# Altium schematic sheet IOT_GRN_MAIN V1.0 A - ESP32.SchDoc
size A4; SheetNumber: 2; SheetTotal: 4; Sheet Title: ESP32-C6
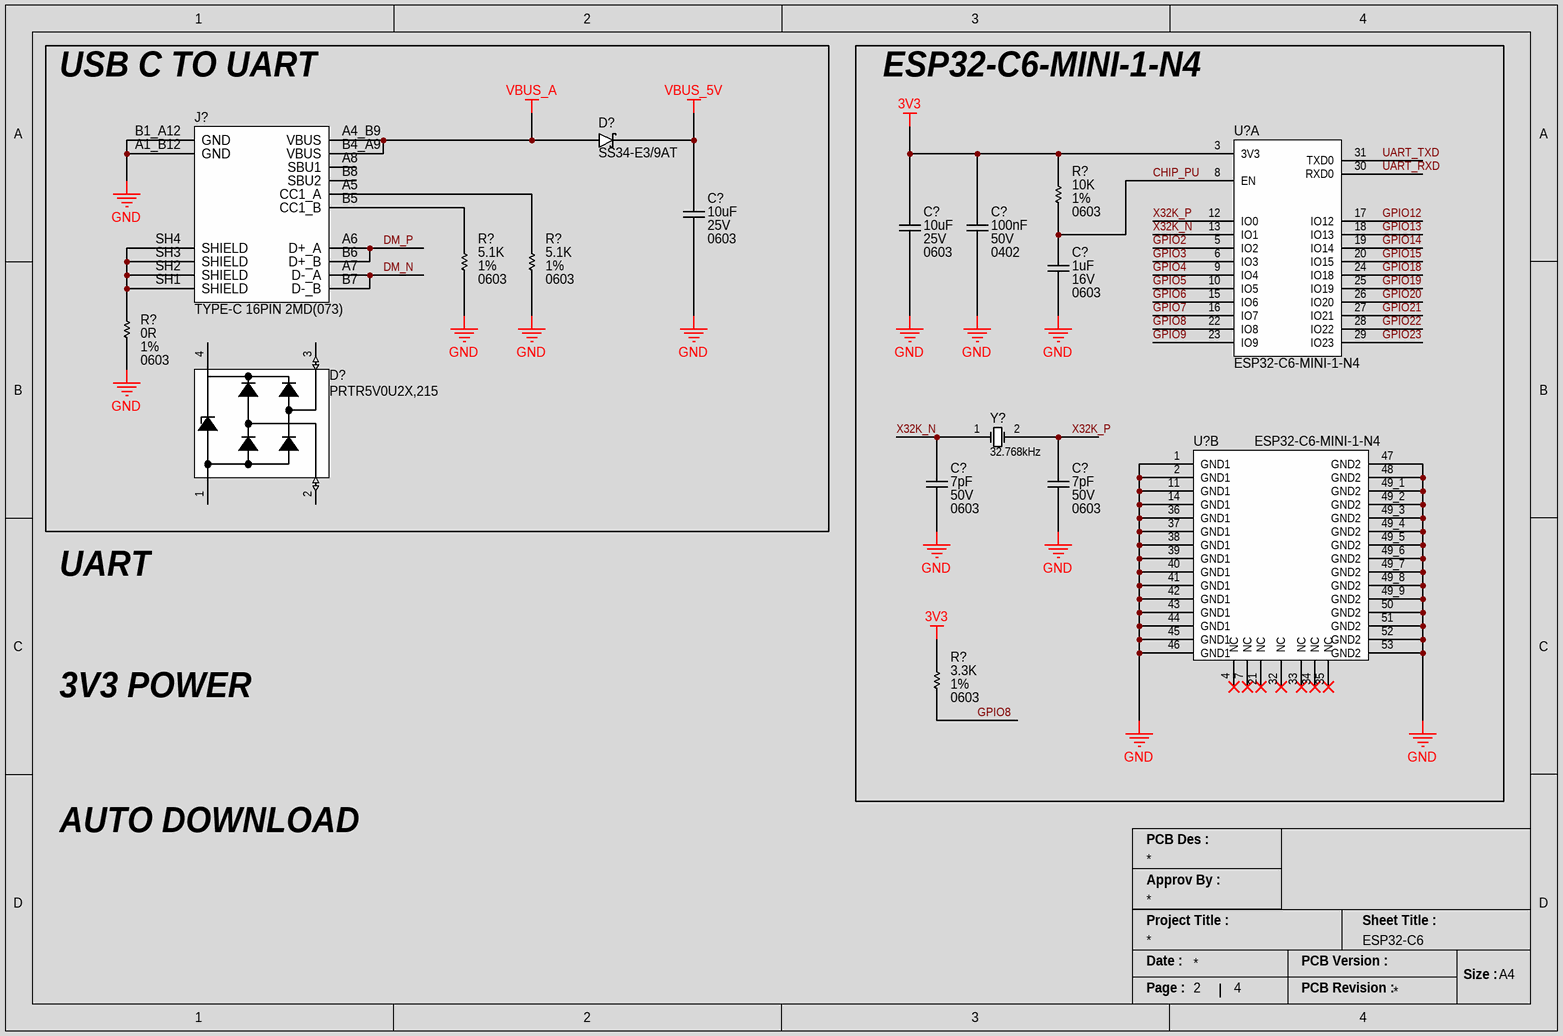
[diagram p0: IOT_GRN_MAIN V1.0 A - ESP32.SchDoc]

## Parts
(Parts that share a designator on the sheet are numbered #1, #2 ... from top to bottom, then left to right.)
C?#1  Case/Package: 0603  Capacitance: 10uF  Voltage Rating: 25V  [CAP_0603_CAPC1608X08N]  (hidden comment: GRM188R61E106MA73D)
C?#2  Case/Package: 0603  Capacitance: 10uF  Voltage Rating: 25V  [CAP_0603_CAPC1608X08N]  (hidden comment: GRM188R61E106MA73D)
C?#3  Voltage Rating: 50V  Capacitance: 100nF  Case/Package: 0402  [CAP_0402_CAPC1005X05N]  (hidden comment: GRM155R71H104KE14D)
C?#4  Voltage Rating: 16V  Capacitance: 1uF  Case/Package: 0603  [CAP_0603_CAPC1608X08N]  (hidden comment: CL10A105KO8NNNC)
C?#5  Voltage Rating (DC): 50V  Capacitance: 7pF  Case/Package: 0603  [CAP_0603_CAPC1608X08N]  (hidden comment: C1608C0G1H070D080AA)
C?#6  Voltage Rating (DC): 50V  Capacitance: 7pF  Case/Package: 0603  [CAP_0603_CAPC1608X08N]  (hidden comment: C1608C0G1H070D080AA)
D?#1  SS34-E3/9AT  [DIO_Vishay_SMC_MFG]
D?#2  PRTR5V0U2X,215  [DIO_TVS_Nexperia_SOT143B_MFG]
J?  TYPE-C 16PIN 2MD(073)  [CONN_USB_C_16P]
R?#1  Resistance: 10K  Tolerance: 1%  Case/Package: 0603  [RES_0603_RESC1608X04N]  (hidden comment: AC0603FR-1010KL)
R?#2  Tolerance: 1%  Resistance: 5.1K  Case/Package: 0603  [RES_0603_RESC1608X04N]  (hidden comment: RC0603FR-075K1L)
R?#3  Tolerance: 1%  Resistance: 5.1K  Case/Package: 0603  [RES_0603_RESC1608X04N]  (hidden comment: RC0603FR-075K1L)
R?#4  Tolerance: 1%  Resistance: 0R  Case Code (Imperial): 0603  [RES_0603_RESC1608X04N]  (hidden comment: RC0603FR-070RL)
R?#5  Tolerance: 1%  Resistance: 3.3K  Case/Package: 0603  [RES_0603_RESC1608X04N]  (hidden comment: RC0603FR-073K3L)
U?#1  ESP32-C6-MINI-1-N4  [IC_ESP32-C6-MINI-1-N4]  (part A of 2)
U?#2  ESP32-C6-MINI-1-N4  [IC_ESP32-C6-MINI-1-N4]  (part B of 2)
Y?  Frequency: 32.768kHz  [CRYSTAL_FC135327680KAAG5]  (hidden comment: FC-135 32.7680KA-AG5)

## Blocks framed on the sheet
USB C TO UART: C?#1 D?#1 D?#2 J? R?#2-R?#4
ESP32-C6-MINI-1-N4: C?#2-C?#6 R?#1 R?#5 U?#1 U?#2 Y?

## Nets
3V3: C?#2.2 C?#3.2 R?#1.2 R?#5.2 U?#1.3(3V3)
GND: C?#1.1 C?#2.1 C?#3.1 C?#4.1 C?#5.2 C?#6.1 J?.A1_B12(GND) J?.B1_A12(GND) R?#2.1 R?#3.1 R?#4.1 U?#2.1(GND1) U?#2.2(GND1) U?#2.11(GND1) U?#2.14(GND1) U?#2.36(GND1) U?#2.37(GND1) U?#2.38(GND1) U?#2.39(GND1) U?#2.40(GND1) U?#2.41(GND1) U?#2.42(GND1) U?#2.43(GND1) U?#2.44(GND1) U?#2.45(GND1) U?#2.46(GND1) U?#2.47(GND2) U?#2.48(GND2) U?#2.49_1(GND2) U?#2.49_2(GND2) U?#2.49_3(GND2) U?#2.49_4(GND2) U?#2.49_5(GND2) U?#2.49_6(GND2) U?#2.49_7(GND2) U?#2.49_8(GND2) U?#2.49_9(GND2) U?#2.50(GND2) U?#2.51(GND2) U?#2.52(GND2) U?#2.53(GND2)
VBUS_5V: C?#1.2 D?#1.1(K)
VBUS_A: D?#1.2(A) J?.A4_B9(VBUS) J?.B4_A9(VBUS)
CHIP_PU: C?#4.2 R?#1.1 U?#1.8(EN)
DM_N: J?.A7(D-_A) J?.B7(D-_B)
DM_P: J?.A6(D+_A) J?.B6(D+_B)
GPIO2: U?#1.5(IO2)
GPIO3: U?#1.6(IO3)
GPIO4: U?#1.9(IO4)
GPIO5: U?#1.10(IO5)
GPIO6: U?#1.15(IO6)
GPIO7: U?#1.16(IO7)
GPIO8: R?#5.1 U?#1.22(IO8)
GPIO9: U?#1.23(IO9)
GPIO12: U?#1.17(IO12)
GPIO13: U?#1.18(IO13)
GPIO14: U?#1.19(IO14)
GPIO15: U?#1.20(IO15)
GPIO18: U?#1.24(IO18)
GPIO19: U?#1.25(IO19)
GPIO20: U?#1.26(IO20)
GPIO21: U?#1.27(IO21)
GPIO22: U?#1.28(IO22)
GPIO23: U?#1.29(IO23)
UART_RXD: U?#1.30(RXD0)
UART_TXD: U?#1.31(TXD0)
X32K_N: C?#6.2 U?#1.13(IO1) Y?.1(OSC1)
X32K_P: C?#5.1 U?#1.12(IO0) Y?.2(OSC2)
NetJ?_A5: J?.A5(CC1_A) R?#3.2
NetJ?_B5: J?.B5(CC1_B) R?#2.2
NetJ?_SH1: J?.SH1(SHIELD) J?.SH2(SHIELD) J?.SH3(SHIELD) J?.SH4(SHIELD) R?#4.2

Not connected (* = marked no-connect by the designer): D?#2 1(GND) 2(I/O_1) 3(I/O_2) 4(VCC); J? A8(SBU1) B8(SBU2); U?#2 4(NC)* 7(NC)* 21(NC)* 32(NC)* 33(NC)* 34(NC)* 35(NC)*

## Notes on the sheet
- UART
- 3V3 POWER
- AUTO DOWNLOAD
- PCB Des :
- Approv By :
- Project Title :
- Sheet Title :
- Date :
- PCB Version :
- Size :
- A4
- Page :
- PCB Revision :

## Library data of the parts
C?#1 C?#2 = CAP_10UF_25V_X5R_0603: Multilayer Ceramic Capacitor, 10 uF, 25 V, ± 20%, X5R, 0603 [1608 Metric]; Manufacturer: Murata; Material: 4241ConductorMaterial; Supplier 1: Digi-Key; Manufacturer Part Number: GRM188R61E106MA73D; RoHS: Yes; Category: Ceramic Capacitors; Stock 1: 2712970; Pricing 1: 1=0.26, 10=0.168, 50=0.1176, 100=0.0949, 500=0.07054, 1000=0.06173 (USD); Mount: Surface Mount; Number of Pins: 2; Case Code (Imperial): 0603; Weight: 0.000222oz; Min Operating Temperature: -55°C; Max Operating Temperature: 85°C; Tolerance: 20%; Packaging: Cut Tape; Package Quantity: 1; Dielectric: X5R; Voltage: 25V; Termination: SMD/SMT; Voltage Rating (DC): 25V; Series: GRM; Construction: Flat; Length: 1.6mm; Width: 0.031inch; Height: 0.8mm; Thickness: 0.031inch; Depth: 0.8mm; Reach SVHC Compliant: No; Lead Free: Lead Free; RoHS Compliant: Yes; ComponentLink1URL: https://datasheet.ciiva.com/22776/c02e-22776427.pdf?src-supplier=Farnell; ComponentLink1Description: https://datasheet.ciiva.com/22776/c02e-22776427.pdf?src-supplier=Farnell; ComponentLink2URL: https://datasheet.ciiva.com/22619/c02e-22619674.pdf?src-supplier=Element14; ComponentLink2Description: https://datasheet.ciiva.com/22619/c02e-22619674.pdf?src-supplier=Element14; ComponentLink3URL: https://datasheet.ciiva.com/22776/608985-22776426.pdf?src-supplier=Farnell; ComponentLink3Description: https://datasheet.ciiva.com/22776/608985-22776426.pdf?src-supplier=Farnell; ComponentLink4URL: https://datasheet.ciiva.com/14906/partnumbering-e-01-14906431.pdf?src-supplier=Digi-Key; ComponentLink4Description: https://datasheet.ciiva.com/14906/partnumbering-e-01-14906431.pdf?src-supplier=Digi-Key; ComponentLink5URL: https://datasheet.ciiva.com/14906/partnumbering-e-01-14906429.pdf?src-supplier=Digi-Key; ComponentLink5Description: https://datasheet.ciiva.com/14906/partnumbering-e-01-14906429.pdf?src-supplier=Digi-Key; Supplier Part Number 1: 490-7202-1-ND; Case Code (Metric): 1608
C?#3 = CAP_100NF_50V_X7R_0402: Multilayer Ceramic Capacitor, 0.1 uF, 16 V, ± 10%, X7R, 0402 [1005 Metric]; Manufacturer: Murata; Dissipation Factor: 0.025%; Temperature Coefficient: 30ppm/°C; Supplier 1: DigiKey; Manufacturer Part Number: GRM155R71H104KE14D; RoHS: Yes; Category: Ceramic Capacitors; Stock 1: 13730790; Pricing 1: 1=0.1, 10=0.023, 50=0.0132, 100=0.0102, 500=0.00768, 1000=0.00603, 2500=0.00548, 5000=0.00504 (USD); Mount: Surface Mount; Number of Pins: 2NUMBER; Case Code (Metric): 1005; Material: Ceramic; Case Code (Imperial): 0402; Weight: 0.000212oz; Dielectric Material: Ceramic; Min Operating Temperature: -55°C; Max Operating Temperature: 125°C; Packaging: Tape and Reel; Package Quantity: 10000; Series: GRM; Tolerance: 10%; Dielectric: X7R; Termination: SMD/SMT; Voltage: 50V; Voltage Rating (DC): 50V; Construction: Flat; Length: 1mm; Width: 0.5mm; Height: 0.5mm; Depth: 0.5mm; Thickness: 0.022inch; Reach SVHC Compliant: No; RoHS Compliant: Yes; Lead Free: 5697LeadFree; ComponentLink1URL: http://www.farnell.com/datasheets/2079156.pdf?src-supplier=Farnell; ComponentLink1Description: http://www.farnell.com/datasheets/2079156.pdf?src-supplier=Farnell; ComponentLink2URL: http://www.mouser.com/ds/2/281/c02e-2905.pdf?src-supplier=Mouser; ComponentLink2Description: http://www.mouser.com/ds/2/281/c02e-2905.pdf?src-supplier=Mouser; ComponentLink3URL: http://www.farnell.com/datasheets/2079156.pdf?src-supplier=Newark; ComponentLink3Description: http://www.farnell.com/datasheets/2079156.pdf?src-supplier=Newark; ComponentLink4URL: https://datasheet.octopart.com/GRM155R71H104KE14D-Murata-datasheet-22122223.pdf?src-supplier=Future+Electronics; ComponentLink4Description: https://datasheet.octopart.com/GRM155R71H104KE14D-Murata-datasheet-22122223.pdf?src-supplier=Future+Electronics; ComponentLink5URL: https://search.murata.co.jp/Ceramy/image/img/A01X/G101/ENG/GRM155R71H104KE14-01.pdf?src-supplier=Digi-Key; ComponentLink5Description: https://search.murata.co.jp/Ceramy/image/img/A01X/G101/ENG/GRM155R71H104KE14-01.pdf?src-supplier=Digi-Key; ComponentLink6URL: http://psearch.en.murata.com/capacitor/product/GRM155R71H104KE14%23.pdf?src-supplier=Avnet; ComponentLink6Description: http://psearch.en.murata.com/capacitor/product/GRM155R71H104KE14%23.pdf?src-supplier=Avnet; ComponentLink7URL: https://datasheet.octopart.com/GRM155R71H104KE14D-Murata-datasheet-66077078.pdf?src-supplier=Element14; ComponentLink7Description: https://datasheet.octopart.com/GRM155R71H104KE14D-Murata-datasheet-66077078.pdf?src-supplier=Element14; Supplier Part Number 1: 490-10700-6-ND; Supplier 2: Digikey; Stock 2: 3706055; Pricing 2: 1=0.1, 10=0.037, 50=0.021, 100=0.0162, 500=0.01224, 1000=0.00961, 2500=0.00874, 5000=0.00804 (USD); Halogen Free: 5694HalogenFree; ComponentLink8URL: http://www.mouser.com/ds/2/447/UPY-GPHC_X5R_4V-to-50V_25-1131599.pdf?src-supplier=Mouser; ComponentLink8Description: http://www.mouser.com/ds/2/447/UPY-GPHC_X5R_4V-to-50V_25-1131599.pdf?src-supplier=Mouser; ComponentLink9URL: https://datasheet.octopart.com/CC0402KRX5R8BB104-Yageo-datasheet-137700082.pdf?src-supplier=Future+Electronics; ComponentLink9Description: https://datasheet.octopart.com/CC0402KRX5R8BB104-Yageo-datasheet-137700082.pdf?src-supplier=Future+Electronics; ComponentLink10URL: http://www.yageo.com/documents/recent/UPY-GPHC_X5R_4V-to-50V_25.pdf?src-supplier=Digikey; ComponentLink10Description: http://www.yageo.com/documents/recent/UPY-GPHC_X5R_4V-to-50V_25.pdf?src-supplier=Digikey; ComponentLink11URL: https://datasheet.octopart.com/CC0402KRX5R8BB104-Yageo-datasheet-140260304.pdf?src-supplier=Newark; ComponentLink11Description: https://datasheet.octopart.com/CC0402KRX5R8BB104-Yageo-datasheet-140260304.pdf?src-supplier=Newark; ComponentLink12URL: https://datasheet.octopart.com/CC0402KRX5R8BB104-Yageo-datasheet-170350636.pdf?src-supplier=Future+Electronics; ComponentLink12Description: https://datasheet.octopart.com/CC0402KRX5R8BB104-Yageo-datasheet-170350636.pdf?src-supplier=Future+Electronics; ComponentLink13URL: http://www.yageo.com/documents/recent/UPY-GPHC_X5R_4V-to-50V-16.pdf?src-supplier=Future+Electronics; ComponentLink13Description: http://www.yageo.com/documents/recent/UPY-GPHC_X5R_4V-to-50V-16.pdf?src-supplier=Future+Electronics; Supplier Part Number 2: 311-1697-1-ND
C?#4 = CAP_1UF_16V_X5R_0603: CAP CER 1UF 16V X5R 0603; Manufacturer: Samsung; Material: Ceramic; Tolerance: 10%; Manufacturer Part Number: CL10A105KO8NNNC; RoHS: Yes; Category: Ceramic Capacitors; Stock 1: 252255; Pricing 1: 1=0.10000, 10=0.03300, 50=0.01800, 100=0.01470, 500=0.01050, 1000=0.00825 (USD); Mount: Surface Mount; Case Code (Metric): 1608; Case Code (Imperial): 0603; Contact Plating: Tin; Min Operating Temperature: -55°C; Max Operating Temperature: 85°C; Package Quantity: 1; Packaging: Tape and Reel; Dielectric: X5R; Voltage Rating (DC): 16V; Series: CL; Voltage: 16V; Construction: Flat; Length: 1.6mm; Width: 0.031inch; Height: 0.8mm; Thickness: 0.035inch; Depth: 0.8mm; Radiation Hardening: No; Lead Free: Lead Free; RoHS Compliant: Yes; ComponentLink1URL: https://datasheet.ciiva.com/16199/cl10a105ko8nnnc-16199033.pdf?src-supplier=Future+Electronics; ComponentLink1Description: https://datasheet.ciiva.com/16199/cl10a105ko8nnnc-16199033.pdf?src-supplier=Future+Electronics; ComponentLink2URL: https://datasheet.ciiva.com/15195/getdatasheetpartid-359688-15195706.pdf?src-supplier=Verical; ComponentLink2Description: https://datasheet.ciiva.com/15195/getdatasheetpartid-359688-15195706.pdf?src-supplier=Verical; ComponentLink3URL: https://datasheet.ciiva.com/29198/458190-da-01-en-vs-kondensator-0603-29198480.pdf?src-supplier=Conrad; ComponentLink3Description: https://datasheet.ciiva.com/29198/458190-da-01-en-vs-kondensator-0603-29198480.pdf?src-supplier=Conrad; Supplier 1: Digi-Key; Supplier 2: Mouser; Supplier 3: Newark; Supplier Part Number 1: 1276-1034-1-ND; Supplier Part Number 2: 187-CL10A105KO8NNNC; Supplier Part Number 3: 82AC9279
C?#5 C?#6 = CAP_7PF_50V_NP0_0603: C Series 0603 7 pF 50 V ±0.5 pF Tolerance C0G SMT Multilayer Ceramic Capacitor; Manufacturer: TDK; Supplier 1: Digi-Key; Manufacturer Part Number: C1608C0G1H070D080AA; RoHS: Yes; Category: Ceramic Capacitors; Stock 1: 64389; Pricing 1: 1=0.1, 10=0.073, 50=0.0414, 100=0.0343, 500=0.02402, 1000=0.01989 (USD); Mount: Surface Mount; Dielectric Material: Ceramic; Case Code (Metric): 1608; Case Code (Imperial): 0603; Weight: 7.1E-05oz; Min Operating Temperature: -55°C; Max Operating Temperature: 125°C; Construction: Flat; Packaging: Tape and Reel; Voltage Rating: 50V; Package Quantity: 4000; Dielectric: C0G; Termination: SMD/SMT; Series: C; Length: 1.6mm; Width: 0.8mm; Height: 0.8mm; Depth: 0.8mm; Lead Free: Lead Free; RoHS Compliant: Yes; Reach SVHC Compliant: No; ComponentLink1URL: https://datasheet.ciiva.com/24217/c1608c0g1h070d080aa-264569-24217366.pdf?src-supplier=Mouser; ComponentLink1Description: https://datasheet.ciiva.com/24217/c1608c0g1h070d080aa-264569-24217366.pdf?src-supplier=Mouser; ComponentLink2URL: https://datasheet.ciiva.com/16427/e413-c-16427733.pdf?src-supplier=Future+Electronics; ComponentLink2Description: https://datasheet.ciiva.com/16427/e413-c-16427733.pdf?src-supplier=Future+Electronics; ComponentLink3URL: https://datasheet.ciiva.com/6293/tdkmlcccaprange-6293212.pdf?src-supplier=Digi-Key; ComponentLink3Description: https://datasheet.ciiva.com/6293/tdkmlcccaprange-6293212.pdf?src-supplier=Digi-Key; ComponentLink4URL: https://datasheet.ciiva.com/6293/tdkmlcccaprange-6293215.pdf?src-supplier=Digi-Key; ComponentLink4Description: https://datasheet.ciiva.com/6293/tdkmlcccaprange-6293215.pdf?src-supplier=Digi-Key; Supplier Part Number 1: 445-5041-1-ND
D?#1 = DIO_SCTKY_40V_3A: Rectifier Diode, schottky, 40V V(Rrm), do-214Ab / Smc; Manufacturer: Vishay Semiconductors; Max Surge Current: 100A; Element Configuration: Single; Max Reverse Leakage Current: 500uA; Average Rectified Current: 3A; Forward Voltage: 500mV; Supplier 1: TTI; Manufacturer Part Number: SS34-E3/9AT; RoHS: Yes; Category: Rectifier Diodes; Stock 1: 7000; Pricing 1: 3500=0.18200 (USD); Mount: Surface Mount; Case/Package: SMC; Number of Pins: 2; Min Operating Temperature: -55°C; Max Operating Temperature: 125°C; Package Quantity: 3500; Packaging: Tape and Reel; Peak Non-Repetitive Surge Current: 100A; Max Reverse Voltage (DC): 40V; Series: -; Radiation Hardening: No; RoHS Compliant: Yes; ComponentLink1URL: https://datasheet.ciiva.com/920/ss32-920172.pdf?src-supplier=Digi-Key; ComponentLink1Description: https://datasheet.ciiva.com/920/ss32-920172.pdf?src-supplier=Digi-Key; Supplier Part Number 1: SS34-E3/9AT; Max Reverse Current: 500uA; Max Repetitive Reverse Voltage (Vrrm): 40V; Forward Current: 3A
D?#2 = DIO_TVS_USB_PRTR5V0U2X,215: PRTR5V0U2X - Ultra low capacitance double rail-to-rail ESD protection diode; Manufacturer: Nexperia; Supplier 1: Mouser; Manufacturer Part Number: PRTR5V0U2X,215; RoHS: Yes; Category: ESD and Circuit Protection ICs; Stock 1: 109301; Pricing 1: 1=0.45, 10=0.368, 50=0.367, 100=0.262, 500=0.21, 1000=0.171, 3000=0.135, 9000=0.129, 10000=0.129, 24000=0.127, 45000=0.125 (USD); RoHS Compliant: Yes; ComponentLink1URL: http://www.farnell.com/datasheets/109718.pdf?src-supplier=Farnell; ComponentLink1Description: http://www.farnell.com/datasheets/109718.pdf?src-supplier=Farnell; ComponentLink2URL: https://assets.nexperia.com/documents/data-sheet/PRTR5V0U2X.pdf?src-supplier=Digikey; ComponentLink2Description: https://assets.nexperia.com/documents/data-sheet/PRTR5V0U2X.pdf?src-supplier=Digikey; ComponentLink3URL: http://www.farnell.com/datasheets/109718.pdf?src-supplier=Newark; ComponentLink3Description: http://www.farnell.com/datasheets/109718.pdf?src-supplier=Newark; ComponentLink4URL: https://datasheet.octopart.com/PRTR5V0U2X%2C215-Nexperia-datasheet-5405949.pdf?src-supplier=Element14; ComponentLink4Description: https://datasheet.octopart.com/PRTR5V0U2X%2C215-Nexperia-datasheet-5405949.pdf?src-supplier=Element14; Supplier Part Number 1: 771-PRTR5V0U2X-T/R
J? = CONN_USB_TYPEC_2.0_16P_TYPE-C 16PIN 2MD(073): 5A 1 Surface Mount 16P Female -25℃~+85℃ Type-C SMD USB Connectors ROHS; Manufacturer: SHOU HAN; Supplier 1: LCSC; Manufacturer Part Number: TYPE-C 16PIN 2MD(073); RoHS: No; Category: Connectors; Pricing 1: 0.0523 (USD); Supplier Part Number 1: 664-12402012E212ACT-ND
R?#1 = RES_10K_1%_100mW_0603: Chip Resistor Automotive Grade Thick Film 0603 10kOhm 1% Paper T/R; Manufacturer: Yageo; Voltage Rating: 50V; Power Rating: 100mW; Temperature Coefficient: 100ppm/°C; Manufacturer Part Number: AC0603FR-1010KL; RoHS: Yes; Category: Chip SMD Resistors; Stock 1: 172891; Pricing 1: 1=0.10000, 10=0.02500, 100=0.01030, 1000=0.00463, 2500=0.00402, 5000=0.00332 (USD); Case Code (Imperial): 0603; Case Code (Metric): 1608; Weight: 7.1E-05oz; Min Operating Temperature: -55°C; Max Operating Temperature: 155°C; Packaging: Tape and Reel; Termination: SMD/SMT; Series: AC; Length: 1.6mm; Width: 0.8mm; Height: 0.45mm; RoHS Compliant: Yes; ComponentLink1URL: http://www.mouser.com/ds/2/447/yageodocoutput-1111992.pdf?src-supplier=Mouser; ComponentLink1Description: http://www.mouser.com/ds/2/447/yageodocoutput-1111992.pdf?src-supplier=Mouser; Supplier 1: Digi-Key; Supplier 2: Newark; Supplier 3: Avnet; Supplier Part Number 1: 13-AC0603FR-1010KLCT-ND; Supplier Part Number 2: 49AK0662; Supplier Part Number 3: 49AK0662
R?#2 R?#3 = RES_5.1K_1%_100mW_0603: SMD Chip Resistor, 5.1 kOhm, ± 1%, 100 mW, 0603 [1608 Metric], Thick Film, General Purpose; Manufacturer: Yageo; Power Rating: 100mW; Temperature Coefficient: 100ppm/°C; Voltage Rating (DC): 50V; Supplier 1: Digi-Key; Manufacturer Part Number: RC0603FR-075K1L; RoHS: Yes; Category: Chip SMD Resistors; Stock 1: 3197702; Pricing 1: 1=0.1, 10=0.018, 50=0.0106, 100=0.0088, 500=0.00592, 1000=0.00505 (USD); Number of Pins: 2; Case Code (Imperial): 0603; Case Code (Metric): 1608; Size Code: 0603; Min Operating Temperature: -55°C; Max Operating Temperature: 155°C; Series: RC; Packaging: Tape and Reel; Package Quantity: 1; Termination: SMD/SMT; Resistor Type: Thick Film; Number of Terminations: 2; Max Power Dissipation: 100mW; Features: Moisture Resistant; Resistance Tolerance: 1%; Construction: Rectangular; Length: 0.063inch; Width: 0.031inch; Height: 0.022inch; Depth: 0.8mm; RoHS Compliant: Yes; Reach SVHC Compliant: No; Military Standard: Not; Lead Free: Lead Free; ComponentLink1URL: https://datasheet.ciiva.com/15189/getdatasheetpartid-326732-15189786.pdf?src-supplier=Verical; ComponentLink1Description: https://datasheet.ciiva.com/15189/getdatasheetpartid-326732-15189786.pdf?src-supplier=Verical; ComponentLink2URL: https://datasheet.ciiva.com/46395/443971-46395016.pdf?src-supplier=Element14; ComponentLink2Description: https://datasheet.ciiva.com/46395/443971-46395016.pdf?src-supplier=Element14; ComponentLink3URL: https://datasheet.ciiva.com/2454/pyu-r-int-thick-7-2454045.pdf?src-supplier=Digi-Key; ComponentLink3Description: https://datasheet.ciiva.com/2454/pyu-r-int-thick-7-2454045.pdf?src-supplier=Digi-Key; ComponentLink4URL: https://datasheet.ciiva.com/2454/pyu-r-int-thick-7-2454046.pdf?src-supplier=Digi-Key; ComponentLink4Description: https://datasheet.ciiva.com/2454/pyu-r-int-thick-7-2454046.pdf?src-supplier=Digi-Key; ComponentLink5URL: https://datasheet.ciiva.com/2454/pyu-r-int-thick-7-2454047.pdf?src-supplier=Digi-Key; ComponentLink5Description: https://datasheet.ciiva.com/2454/pyu-r-int-thick-7-2454047.pdf?src-supplier=Digi-Key; Supplier Part Number 1: 311-5.10KHRCT-ND; Voltage Rating: 50V
R?#4 = RES_0R_1%_100mW_0603: RC Series 0603 0.1 W 0 Ohm Jumper Surface Mount Thick Film Chip Resistor; Manufacturer: Yageo; Power Rating: 100mW; Voltage Rating (DC): 50V; Temperature Coefficient: 200ppm/°C; Current Rating: 1A; Working Voltage: 75V; Supplier 1: Digi-Key; Manufacturer Part Number: RC0603FR-070RL; RoHS: Yes; Category: Chip SMD Resistors; Stock 1: 2843917; Pricing 1: 1=0.10000, 10=0.01800, 25=0.01320, 50=0.01000, 100=0.00730, 250=0.00560, 500=0.00448, 1000=0.00329 (USD); Case/Package: 0603; Number of Pins: 2; Contact Plating: Tin,Matte; Case Code (Metric): 1608; Min Operating Temperature: -55°C; Max Operating Temperature: 155°C; Packaging: Tape and Reel; Resistor Type: Thick Film; Package Quantity: 5000; Voltage Rating: 50V; Number of Terminations: 2; Termination: SMD/SMT; Max Power Dissipation: 100mW; Features: Moisture Resistant; Series: RC; Construction: Rectangular; Resistance Tolerance: 1%; Technology: THICK FILM; Length: 1.6mm; Width: 0.8mm; Height: 0.45mm; Depth: 0.8mm; Radiation Hardening: No; Reach SVHC Compliant: Yes; Lead Free: Lead Free; RoHS Compliant: Yes; Military Standard: Not; ComponentLink1URL: https://datasheet.ciiva.com/11808/0900766b80f96399-11808172.pdf?src-supplier=Rs; ComponentLink1Description: https://datasheet.ciiva.com/11808/0900766b80f96399-11808172.pdf?src-supplier=Rs; ComponentLink2URL: https://datasheet.ciiva.com/5684/443971-5684699.pdf?src-supplier=Farnell; ComponentLink2Description: https://datasheet.ciiva.com/5684/443971-5684699.pdf?src-supplier=Farnell; ComponentLink3URL: https://datasheet.ciiva.com/7983/443971-7983627.pdf?src-supplier=Element14; ComponentLink3Description: https://datasheet.ciiva.com/7983/443971-7983627.pdf?src-supplier=Element14; ComponentLink4URL: https://datasheet.ciiva.com/22643/1868787-22643388.pdf?src-supplier=Element14; ComponentLink4Description: https://datasheet.ciiva.com/22643/1868787-22643388.pdf?src-supplier=Element14; ComponentLink5URL: https://datasheet.ciiva.com/46382/443971-46382072.pdf?src-supplier=Element14; ComponentLink5Description: https://datasheet.ciiva.com/46382/443971-46382072.pdf?src-supplier=Element14; ComponentLink6URL: https://datasheet.ciiva.com/29721/pyu-r-int-thick-7-29721178.pdf?src-supplier=Digi-Key; ComponentLink6Description: https://datasheet.ciiva.com/29721/pyu-r-int-thick-7-29721178.pdf?src-supplier=Digi-Key; ComponentLink7URL: https://datasheet.ciiva.com/29721/pyu-rc0603-51-rohs-l-4-29721179.pdf?src-supplier=Digi-Key; ComponentLink7Description: https://datasheet.ciiva.com/29721/pyu-rc0603-51-rohs-l-4-29721179.pdf?src-supplier=Digi-Key; ComponentLink8URL: https://datasheet.ciiva.com/5558/rc0603-272842-5558341.pdf?src-supplier=Mouser; ComponentLink8Description: https://datasheet.ciiva.com/5558/rc0603-272842-5558341.pdf?src-supplier=Mouser; Supplier Part Number 1: 311-0.0HRCT-ND
R?#5 = RES_3.3K_1%_100mW_0603: SMD Chip Resistor, 3.3 kOhm, ± 1%, 100 mW, 0603 [1608 Metric], Thick Film, General Purpose; Manufacturer: Yageo; Voltage Rating (DC): 50V; Temperature Coefficient: 100ppm/°C; Power Rating: 100mW; Supplier 1: Digikey; Manufacturer Part Number: RC0603FR-073K3L; RoHS: Yes; Category: Chip SMD Resistors; Stock 1: 374027; Pricing 1: 1=0.1, 10=0.019, 50=0.0112, 100=0.0093, 500=0.00622, 1000=0.00532 (USD); Number of Pins: 2; Case Code (Imperial): 0603; Case Code (Metric): 1608; Size Code: 0603; Min Operating Temperature: -55°C; Max Operating Temperature: 155°C; Packaging: Tape and Reel; Resistor Type: Thick Film; Voltage Rating: 50V; Package Quantity: 1; Termination: SMD/SMT; Number of Terminations: 2; Max Power Dissipation: 100mW; Features: Moisture Resistant; Series: RC; Resistance Tolerance: 1%; Construction: Rectangular; Voltage Rating (AC): 50V; Length: 1.6mm; Width: 0.8mm; Height: 0.022inch; Depth: 0.8mm; Reach SVHC Compliant: No; Lead Free: Lead Free; Military Standard: Not; RoHS Compliant: Yes; ComponentLink1URL: https://datasheet.ciiva.com/2453/pyu-r-int-thick-7-2453926.pdf?src-supplier=Digikey; ComponentLink1Description: https://datasheet.ciiva.com/2453/pyu-r-int-thick-7-2453926.pdf?src-supplier=Digikey; ComponentLink2URL: https://datasheet.ciiva.com/2453/pyu-r-int-thick-7-2453927.pdf?src-supplier=Digikey; ComponentLink2Description: https://datasheet.ciiva.com/2453/pyu-r-int-thick-7-2453927.pdf?src-supplier=Digikey; ComponentLink3URL: https://datasheet.ciiva.com/7746/443971-7746344.pdf?src-supplier=Element14; ComponentLink3Description: https://datasheet.ciiva.com/7746/443971-7746344.pdf?src-supplier=Element14; ComponentLink4URL: https://datasheet.ciiva.com/7746/1686128-7746345.pdf?src-supplier=Element14; ComponentLink4Description: https://datasheet.ciiva.com/7746/1686128-7746345.pdf?src-supplier=Element14; ComponentLink5URL: https://datasheet.ciiva.com/7746/443971-7746346.pdf?src-supplier=Element14; ComponentLink5Description: https://datasheet.ciiva.com/7746/443971-7746346.pdf?src-supplier=Element14; ComponentLink6URL: https://datasheet.ciiva.com/46440/1868787-46440905.pdf?src-supplier=Element14; ComponentLink6Description: https://datasheet.ciiva.com/46440/1868787-46440905.pdf?src-supplier=Element14; Supplier Part Number 1: 311-3.30KHRCT-ND
U?#1 U?#2 = IC_MCU_ESP32-C6-MINI-1-N4: Rf Txrx Module Bt Pcb Trace SMD; Manufacturer: Espressif Systems; Supplier 1: Digikey; Manufacturer Part Number: ESP32-C6-MINI-1-N4; RoHS: No; Stock 1: 29; Pricing 1: 1=2.5 (USD); Supplier Part Number 1: 1965-ESP32-C6-MINI-1-N4CT-ND
Y? = CRYSTAL_EPSON_32.768KHZ: Crystal 0.032768MHz ±20ppm (Tol) 7pF FUND 70000Ohm 2-Pin SMD T/R; Manufacturer: Epson; ESR (Equivalent Series Resistance): 70kR; Supplier 1: Digi-Key; Manufacturer Part Number: FC-135 32.7680KA-AG5; RoHS: Yes; Category: Crystals; Stock 1: 220593; Pricing 1: 1=0.61, 10=0.505, 50=0.4544, 100=0.404, 500=0.3838, 1000=0.3232 (USD); Mount: Surface Mount; Case/Package: SMD/SMT; Min Operating Temperature: -40°C; Max Operating Temperature: 85°C; Packaging: Tape and Reel; Load Capacitance: 7pF; Frequency Tolerance: 20ppm; Series: FC-135; Length: 0.126inch; Width: 0.061inch; Height: 0.035inch; RoHS Compliant: Yes; ComponentLink1URL: https://support.epson.biz/td/api/doc_check.php?dl=brief_FC-135&amp;lang=en&src-supplier=Digi-Key; ComponentLink1Description: https://support.epson.biz/td/api/doc_check.php?dl=brief_FC-135&amp;lang=en&src-supplier=Digi-Key; ComponentLink2URL: https://support.epson.biz/td/api/doc_check.php?dl=brief_FC-135R_en.pdf&src-supplier=Digi-Key; ComponentLink2Description: https://support.epson.biz/td/api/doc_check.php?dl=brief_FC-135R_en.pdf&src-supplier=Digi-Key; ComponentLink3URL: https://datasheet.octopart.com/FC-135-32.7680KA-AG5-Epson-datasheet-140567380.pdf?src-supplier=Arrow.cn; ComponentLink3Description: https://datasheet.octopart.com/FC-135-32.7680KA-AG5-Epson-datasheet-140567380.pdf?src-supplier=Arrow.cn; Supplier Part Number 1: SER4271CT-ND